# Altium schematic sheet 7_Power_Supply.SchDoc
size A4; Organization: SpaceLab UFSC; Address1: UFSC - SpaceLab; Address2: University Campus - Trindade; Address3: Dep. of Electrical Engineering - CTC; Address4: Florianópolis, Santa Catarina, Brazil; Address5: CEP: 88040 - 900
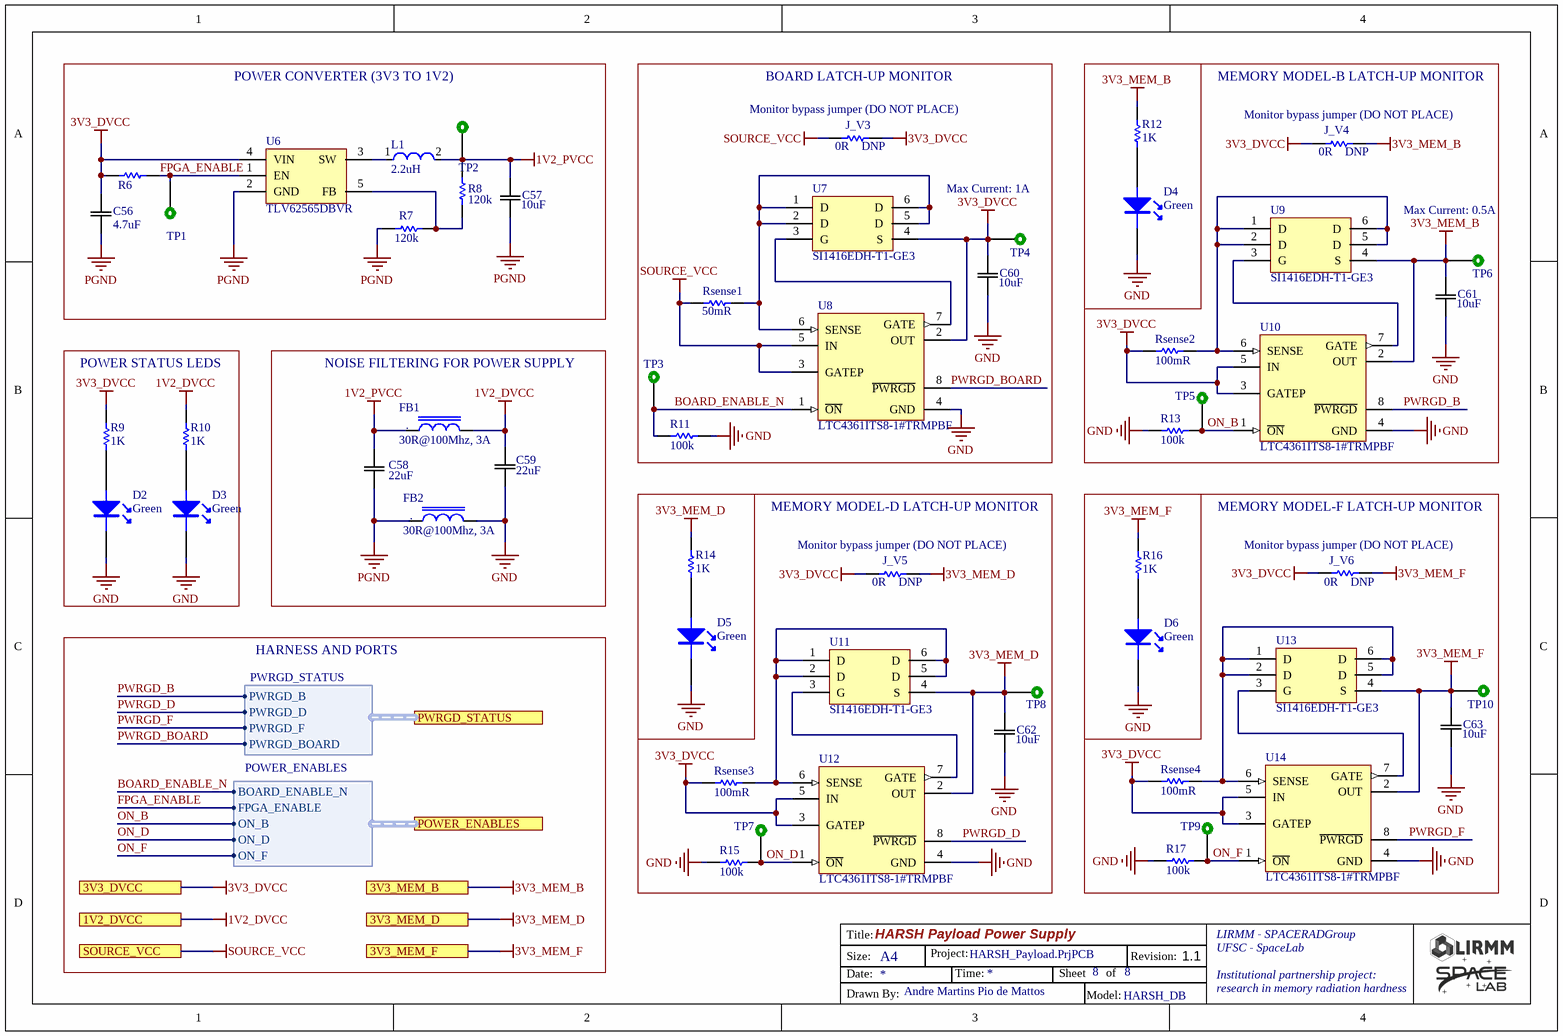
[diagram p0: 7_Power_Supply.SchDoc]

## Parts
C56  4.7uF  [DONE_C0603]
C57  10uF  [DONE_C0603]
C58  22uF  [DONE_C0603]
C59  22uF  [DONE_C0603]
C60  10uF  [DONE_C0603]
C61  10uF  [DONE_C0603]
C62  10uF  [DONE_C0603]
C63  10uF  [DONE_C0603]
D2  Green  [DONE_D0603_GREEN]
D3  Green  [DONE_D0603_GREEN]
D4  Green  [DONE_D0603_GREEN]
D5  Green  [DONE_D0603_GREEN]
D6  Green  [DONE_D0603_GREEN]
FB1  30R@100Mhz, 3A  [DONE_L0805]
FB2  30R@100Mhz, 3A  [DONE_L0805]
J_V3  0R  [DONE_R0603]
J_V4  0R  [DONE_R0603]
J_V5  0R  [DONE_R0603]
J_V6  0R  [DONE_R0603]
L1  value 2.2uH  [DONE_IND_2.2uH]  (hidden comment: DONE_IND_2.2uH)
R6  10k  [DONE_R0603]  (value not drawn)
R7  120k  [DONE_R0603]
R8  120k  [DONE_R0603]
R9  1K  [DONE_R0603]
R10  1K  [DONE_R0603]
R11  100k  [DONE_R0805]
R12  1K  [DONE_R0603]
R13  100k  [DONE_R0805]
R14  1K  [DONE_R0603]
R15  100k  [DONE_R0805]
R16  1K  [DONE_R0603]
R17  100k  [DONE_R0805]
Rsense1  Resistance: 50mR  [DONE_R0603]  (hidden comment: 0.05R)
Rsense2  Resistance: 100mR  [DONE_R0603]  (hidden comment: 0.1)
Rsense3  Resistance: 100mR  [DONE_R0603]  (hidden comment: 0.1)
Rsense4  Resistance: 100mR  [DONE_R0603]  (hidden comment: 0.1)
TP1  TEST_POINT  [DONE_TEST_POINT]  (value not drawn)  (no BOM)
TP2  TEST_POINT  [DONE_TEST_POINT]  (value not drawn)  (no BOM)
TP3  TEST_POINT  [DONE_TEST_POINT]  (value not drawn)  (no BOM)
TP4  TEST_POINT  [DONE_TEST_POINT]  (value not drawn)  (no BOM)
TP5  TEST_POINT  [DONE_TEST_POINT]  (value not drawn)  (no BOM)
TP6  TEST_POINT  [DONE_TEST_POINT]  (value not drawn)  (no BOM)
TP7  TEST_POINT  [DONE_TEST_POINT]  (value not drawn)  (no BOM)
TP8  TEST_POINT  [DONE_TEST_POINT]  (value not drawn)  (no BOM)
TP9  TEST_POINT  [DONE_TEST_POINT]  (value not drawn)  (no BOM)
TP10  TEST_POINT  [DONE_TEST_POINT]  (value not drawn)  (no BOM)
U6  TLV62565DBVR  [DONE_SOT23_5]
U7  SI1416EDH-T1-GE3  [DONE_SOT363_6]
U8  LTC4361ITS8-1#TRMPBF  [DONE_TSOT_23_8]
U9  SI1416EDH-T1-GE3  [DONE_SOT363_6]
U10  LTC4361ITS8-1#TRMPBF  [DONE_TSOT_23_8]
U11  SI1416EDH-T1-GE3  [DONE_SOT363_6]
U12  LTC4361ITS8-1#TRMPBF  [DONE_TSOT_23_8]
U13  SI1416EDH-T1-GE3  [DONE_SOT363_6]
U14  LTC4361ITS8-1#TRMPBF  [DONE_TSOT_23_8]

## Blocks framed on the sheet
POWER CONVERTER (3V3 TO 1V2): C56 C57 L1 R6-R8 TP1 TP2 U6
BOARD LATCH-UP MONITOR: C60 J_V3 R11 Rsense1 TP3 TP4 U7 U8
MEMORY MODEL-B LATCH-UP MONITOR: C61 D4 J_V4 R12 R13 Rsense2 TP5 TP6 U9 U10
POWER STATUS LEDS: D2 D3 R9 R10
NOISE FILTERING FOR POWER SUPPLY: C58 C59 FB1 FB2
MEMORY MODEL-D LATCH-UP MONITOR: C62 D5 J_V5 R14 R15 Rsense3 TP7 TP8 U11 U12
MEMORY MODEL-F LATCH-UP MONITOR: C63 D6 J_V6 R16 R17 Rsense4 TP9 TP10 U13 U14

## Ports
1V2_DVCC, 3V3_DVCC, 3V3_MEM_B, 3V3_MEM_D, 3V3_MEM_F, POWER_ENABLES (harness POWER_ENABLES), PWRGD_STATUS (harness PWRGD_STATUS), SOURCE_VCC

## Harnesses
PWRGD_STATUS: PWRGD_B, PWRGD_D, PWRGD_F, PWRGD_BOARD
POWER_ENABLES: FPGA_ENABLE, ON_B, BOARD_ENABLE_N, ON_D, ON_F

## Nets
1V2_DVCC: C59.1 FB1.2 R10.2 ; port 1V2_DVCC
1V2_PVCC: C57.1 C58.1 FB1.1 L1.2 R8.2 TP2.1
3V3_DVCC: C56.1 C60.1 J_V3.1 J_V4.2 J_V5.2 J_V6.2 R6.2 R9.2 Rsense2.2 Rsense3.2 Rsense4.2 TP4.1 U6.4(VIN) U7.4(S) U8.2(OUT) U10.3(GATEP) U10.5(IN) U12.3(GATEP) U12.5(IN) U14.3(GATEP) U14.5(IN) ; port 3V3_DVCC
3V3_MEM_B: C61.1 J_V4.1 R12.2 TP6.1 U9.4(S) U10.2(OUT) ; port 3V3_MEM_B
3V3_MEM_D: C62.1 J_V5.1 R14.2 TP8.1 U11.4(S) U12.2(OUT) ; port 3V3_MEM_D
3V3_MEM_F: C63.1 J_V6.1 R16.2 TP10.1 U13.4(S) U14.2(OUT) ; port 3V3_MEM_F
GND: C59.2 C60.2 C61.2 C62.2 C63.2 D2.2(K) D3.2(K) D4.2(K) D5.2(K) D6.2(K) FB2.2 R11.1 R13.2 R15.2 R17.2 U8.4(GND) U10.4(GND) U12.4(GND) U14.4(GND)
PGND: C56.2 C57.2 C58.2 FB2.1 R7.2 U6.2(GND)
SOURCE_VCC: J_V3.2 Rsense1.2 U8.3(GATEP) U8.5(IN) ; port SOURCE_VCC
BOARD_ENABLE_N: R11.2 TP3.1 U8.1(~{ON}) ; port POWER_ENABLES.BOARD_ENABLE_N
FPGA_ENABLE: R6.1 TP1.1 U6.1(EN) ; port POWER_ENABLES.FPGA_ENABLE
ON_B: R13.1 TP5.1 U10.1(~{ON}) ; port POWER_ENABLES.ON_B
ON_D: R15.1 TP7.1 U12.1(~{ON}) ; port POWER_ENABLES.ON_D
ON_F: R17.1 TP9.1 U14.1(~{ON}) ; port POWER_ENABLES.ON_F
PWRGD_B: U10.8(~{PWRGD}) ; port PWRGD_STATUS.PWRGD_B
PWRGD_BOARD: U8.8(~{PWRGD}) ; port PWRGD_STATUS.PWRGD_BOARD
PWRGD_D: U12.8(~{PWRGD}) ; port PWRGD_STATUS.PWRGD_D
PWRGD_F: U14.8(~{PWRGD}) ; port PWRGD_STATUS.PWRGD_F
NetD2_1: D2.1(A) R9.1
NetD3_1: D3.1(A) R10.1
NetD4_1: D4.1(A) R12.1
NetD5_1: D5.1(A) R14.1
NetD6_1: D6.1(A) R16.1
NetL1_1: L1.1 U6.3(SW)
NetR7_1: R7.1 R8.1 U6.5(FB)
NetRsense1_1: Rsense1.1 U7.1(D) U7.2(D) U7.5(D) U7.6(D) U8.6(SENSE)
NetRsense2_1: Rsense2.1 U9.1(D) U9.2(D) U9.5(D) U9.6(D) U10.6(SENSE)
NetRsense3_1: Rsense3.1 U11.1(D) U11.2(D) U11.5(D) U11.6(D) U12.6(SENSE)
NetRsense4_1: Rsense4.1 U13.1(D) U13.2(D) U13.5(D) U13.6(D) U14.6(SENSE)
NetU7_3: U7.3(G) U8.7(GATE)
NetU9_3: U9.3(G) U10.7(GATE)
NetU11_3: U11.3(G) U12.7(GATE)
NetU13_3: U13.3(G) U14.7(GATE)

## Notes on the sheet
- (near J_V3) Monitor bypass jumper (DO NOT PLACE)
- (near J_V3) DNP
- (near J_V4) Monitor bypass jumper (DO NOT PLACE)
- (near J_V4) DNP
- Max Current: 1A
- Max Current: 0.5A
- (near J_V5) Monitor bypass jumper (DO NOT PLACE)
- (near J_V5) DNP
- (near J_V6) Monitor bypass jumper (DO NOT PLACE)
- (near J_V6) DNP
- HARNESS AND PORTS
- HARSH Payload Power Supply
- HARSH_Payload.PrjPCB
- 8
- 1.1
- Andre Martins Pio de Mattos
- HARSH_DB
- Title:
- Size:
- Date:
- A4
- Project:
- Time:
- Sheet
- of
- Revision:
- LIRMM - SPACERADGroup
- UFSC - SpaceLab
- Institutional partnership project:
- research in memory radiation hardness
- Drawn By:
- Model:
- (in symbol DONE_FB_30R_3A_100MHz_0805) .

## Library data of the parts
C56 = DONE_CAP_4.7uF_0603_X5R: CAP CER 4.7UF 10V 10% X5R 0603; Partnumber: C0603C475K8PACTU; Category: Ceramic; Dielectric: X5R; Voltage: 10V; Value: 4.7uF
C57 C60-C63 = DONE_CAP_10uF_0603_X5R: CAP CER 10uF 16V 0603 X5R; Partnumber: GRM188R61C106KAALD; Manufacturer: Murata; Tolerance: 10%; NCM: 8532.24.10; Supplier 1: Digi-Key; Manufacturer Part Number: GRM188R61C106KAALD; Stock 1: 0; Pricing 1: 1=0.43, 10=0.302, 100=0.1811, 500=0.1358, 1000=0.1147 (USD); Mount: Surface Mount; Case/Package: 0603; Weight: 0.000222oz; Case Code (Metric): 1608; Case Code (Imperial): 0603; Min Operating Temperature: -55°C; Max Operating Temperature: 85°C; Packaging: Tape and Reel; Voltage Rating: 16V; Dielectric: X5R; Termination: SMD/SMT; Composition: Ceramic; Voltage Rating (DC): 16V; Package Quantity: 4000; Length: 0.063inch; Height: 0.8mm; Width: 0.8mm; Thickness: 0.037inch; REACH SVHC: No SVHC; Lead Free: Lead Free; ComponentLink1URL: http://www.farnell.com/datasheets/2079167.pdf; ComponentLink1Description: http://www.farnell.com/datasheets/2079167.pdf; ComponentLink2URL: http://www.mouser.com/ds/2/281/c02e-2905.pdf; ComponentLink2Description: http://www.mouser.com/ds/2/281/c02e-2905.pdf; ComponentLink3URL: http://search.murata.co.jp/Ceramy/image/img/A01X/partnumbering_e_01.pdf; ComponentLink3Description: http://search.murata.co.jp/Ceramy/image/img/A01X/partnumbering_e_01.pdf; Supplier Part Number 1: 490-10728-1-ND; Capacitance: 10uF
C58 C59 = DONE_CAP_22uF_0603_X5R: CAP CER 22UF 10V X5R 0603; Partnumber: CL10A226MPCNUBE; ComponentLink1URL: http://www.farnell.com/datasheets/2079167.pdf; ComponentLink1Description: http://www.farnell.com/datasheets/2079167.pdf; ComponentLink2URL: http://www.mouser.com/ds/2/281/c02e-2905.pdf; ComponentLink2Description: http://www.mouser.com/ds/2/281/c02e-2905.pdf; ComponentLink3URL: http://search.murata.co.jp/Ceramy/image/img/A01X/partnumbering_e_01.pdf; ComponentLink3Description: http://search.murata.co.jp/Ceramy/image/img/A01X/partnumbering_e_01.pdf; Capacitance: 22uF
D2-D6 = DONE_LED_GREEN_0603: SMD Green LED; Partnumber: HSMQ-C191-T0000; ComponentLink1Description: https://www.digikey.com/product-detail/en/lite-on-inc/LTST-C170KFKT/160-1413-1-ND/386774; ComponentLink1URL: https://www.digikey.com/product-detail/en/lite-on-inc/LTST-C170KFKT/160-1413-1-ND/386774; ComponentLink2Description: https://br.mouser.com/ProductDetail/Lite-On/LTST-C170KFKT?qs=%2Fha2pyFadugHsX7bdQzWjMrioqtf8F%2FEFUVxYkqdVx%252BrRWuVMVludQ%3D%3D; ComponentLink2URL: https://br.mouser.com/ProductDetail/Lite-On/LTST-C170KFKT?qs=%2Fha2pyFadugHsX7bdQzWjMrioqtf8F%2FEFUVxYkqdVx%252BrRWuVMVludQ%3D%3D; ComponentLink3URL: https://www.verical.com/server-webapp/html/getDatasheet?partID=158266&src-supplier=Verical; ComponentLink3Description: https://www.verical.com/server-webapp/html/getDatasheet?partID=158266&src-supplier=Verical; ComponentLink4URL: http://optoelectronics.liteon.com/upload/download/DS-22-99-0185/LTST-C170KFKT.pdf?src-supplier=Digi-Key; ComponentLink4Description: http://optoelectronics.liteon.com/upload/download/DS-22-99-0185/LTST-C170KFKT.pdf?src-supplier=Digi-Key; ComponentLink5URL: http://www1.futureelectronics.com/doc/LITE-ON/LTST-C170KFKT.pdf?src-supplier=Future+Electronics; ComponentLink5Description: http://www1.futureelectronics.com/doc/LITE-ON/LTST-C170KFKT.pdf?src-supplier=Future+Electronics; ComponentLink6URL: http://www.mouser.com/ds/2/239/Lite-On-LTST-C170KFKT-187690.pdf?src-supplier=Mouser; ComponentLink6Description: http://www.mouser.com/ds/2/239/Lite-On-LTST-C170KFKT-187690.pdf?src-supplier=Mouser
FB1 FB2 = DONE_FB_30R_3A_100MHz_0805: Ferrite Bead 30 OHM 3A 100MHz; Partnumber: BLM21PG300SN1D; NCM: 8504.50.00
J_V3-J_V6 = DONE_RES_0R_0603: RES SMD 0 OHM JUMPER 1/10W 0603; Partnumber: RC0603JR-070RL; Case Code (Imperial): 0603; ComponentLink1URL: http://www.mouser.com/ds/2/427/mcat_pro-223602.pdf; ComponentLink1Description: http://www.mouser.com/ds/2/427/mcat_pro-223602.pdf; ComponentLink2URL: http://www.vishay.com/docs/28760/mcat_pro.pdf; ComponentLink2Description: http://www.vishay.com/docs/28760/mcat_pro.pdf
L1 = DONE_IND_2.2uH: Inductor Power Chip Shielded Wirewound 2.2uH 20% 1MHz Ferrite 1.8A 0.0588Ohm DCR 1515 T/R; Partnumber: LQH44PN2R2MP0L
R6 = DONE_RES_10K_0603: 1/8W 1%  0603 10K; Partnumber: MCT0603MC1002FP500; Manufacturer: Vishay Beyschlag; Resistance: 10kR; Power Rating: 125mW; Voltage Rating: 75V; NCM: 8533.21.20; Supplier 1: Digi-Key; Manufacturer Part Number: MCT0603MC1002FP500; Stock 1: 29986; Pricing 1: 1=0.37, 10=0.313, 100=0.1222, 1000=0.0511, 2500=0.0469 (USD); Case/Package: 0603; Weight: 7.1E-05oz; Case Code (Imperial): 0603; Case Code (Metric): 1608; Min Operating Temperature: -55°C; Max Operating Temperature: 155°C; Packaging: Tape and Reel; Tolerance: 1%; Package Quantity: 5000; Termination: SMD/SMT; Composition: Thin Film; Length: 1.6mm; Height: 0.45mm; Width: 0.8mm; ComponentLink1URL: http://www.mouser.com/ds/2/427/mcat_pro-223602.pdf; ComponentLink1Description: http://www.mouser.com/ds/2/427/mcat_pro-223602.pdf; ComponentLink2URL: http://www.vishay.com/docs/28760/mcat_pro.pdf; ComponentLink2Description: http://www.vishay.com/docs/28760/mcat_pro.pdf; Supplier Part Number 1: MCT0603-10.0K-MFCT-ND
R7 R8 = DONE_RES_120K_0603: 1/10W 1%  0603; Partnumber: CRCW0603120KFKEAC; Manufacturer: Vishay Beyschlag; Power Rating: 100mW; Voltage Rating: 75V; NCM: 8533.21.20; Manufacturer Part Number: CRCW0603120KFKEAC; Case/Package: 0603; Weight: 7.1E-05oz; Case Code (Imperial): 0603; Case Code (Metric): 1608; Min Operating Temperature: -55°C; Max Operating Temperature: 155°C; Packaging: Tape and Reel; Tolerance: 1%; Termination: SMD/SMT; Composition: Thin Film; Length: 1.55mm; Height: 0.45mm; Width: 0.8mm; Resistance: 120k
R9 R10 R12 R14 R16 = DONE_RES_1K_0603: RES SMD 1K OHM 1% 1/4W 0603; Manufacturer: Rohm; Manufacturer Part Number: ESR03EZPF1001; Power Rating: 250mW; Temperature Coefficient: 100ppm/°C; ComponentLink1Description: digikey; ComponentLink1URL: https://www.digikey.com/product-detail/en/rohm-semiconductor/ESR03EZPF1001/RHM1.00KADCT-ND/1983752; Supplier 1: Digi-Key; Stock 1: 24170; Pricing 1: 1=0.14, 10=0.126, 100=0.0484, 1000=0.0213, 2500=0.0184 (USD); Case/Package: 0603; Case Code (Metric): 1608; Case Code (Imperial): 0603; Min Operating Temperature: -55°C; Max Operating Temperature: 155°C; Package Quantity: 1; Tolerance: 1%; Packaging: Tape and Reel; Composition: Thick Film; Number of Terminations: 2; Max Power Dissipation: 250mW; Length: 0.063inch; Height: 0.022inch; Width: 0.031inch; Lead Free: Lead Free; ComponentLink2URL: https://datasheet.ciiva.com/2469/esr-2469712.pdf; ComponentLink2Description: https://datasheet.ciiva.com/2469/esr-2469712.pdf; ComponentLink3URL: https://datasheet.ciiva.com/2469/esr-2469713.pdf; ComponentLink3Description: https://datasheet.ciiva.com/2469/esr-2469713.pdf; ComponentLink4URL: https://datasheet.ciiva.com/2469/esr-2469714.pdf; ComponentLink4Description: https://datasheet.ciiva.com/2469/esr-2469714.pdf; Supplier Part Number 1: RHM1.00KADCT-ND; Resistance: 1K; Partnumber: ESR03EZPF1001
R11 R13 R15 R17 = DONE_RES_100k_0805: RES 100K OHM 1/8W 1% 0805; Partnumber: AC0805FR-13100KL; Manufacturer: Yageo; Manufacturer Part Number: RC0805FR-07100KL; Temperature Coefficient: 100ppm/°C; Power Rating: 125mW; Voltage Rating (DC): 150V; NCM: 8533.21.20; ComponentLink1Description: https://www.digikey.com/product-detail/en/yageo/RC0805FR-07100KL/311-100KCRCT-ND/730491; ComponentLink1URL: https://www.digikey.com/product-detail/en/yageo/RC0805FR-07100KL/311-100KCRCT-ND/730491; ComponentLink2Description: https://br.mouser.com/ProductDetail/Yageo/RC0805FR-07100KL?qs=%2Fha2pyFadugqH4HCO4lefXR2vnSIcQedeLFD%252BIWbuSwm%252BtiKkObUBg%3D%3D; ComponentLink2URL: https://br.mouser.com/ProductDetail/Yageo/RC0805FR-07100KL?qs=%2Fha2pyFadugqH4HCO4lefXR2vnSIcQedeLFD%252BIWbuSwm%252BtiKkObUBg%3D%3D; Supplier 1: Digi-Key; Supplier Part Number 1: 311-100KCRCT-ND; Stock 1: 5685931; Pricing 1: 1=0.1, 10=0.04, 100=0.0163, 1000=0.00731, 2500=0.00635 (USD); Case/Package: 0805; Number of Pins: 2; Case Code (Metric): 2012; Case Code (Imperial): 0805; Min Operating Temperature: -55°C; Max Operating Temperature: 155°C; Composition: Thick Film; Tolerance: 1%; Packaging: Tape and Reel; Voltage Rating: 150V; Package Quantity: 1; Number of Terminations: 2; Termination: SMD/SMT; Military Standard: Not; Max Power Dissipation: 125mW; Features: Moisture Resistant; Length: 2mm; Height: 0.024inch; Width: 0.049inch; Depth: 1.25mm; Lead Pitch: 0.4mm; REACH SVHC: Unknown; Lead Free: Lead Free; ComponentLink3URL: http://www.yageo.com/documents/recent/PYu-RC_Group_51_RoHS_L_10.pdf?src-supplier=Digi-Key; ComponentLink3Description: http://www.yageo.com/documents/recent/PYu-RC_Group_51_RoHS_L_10.pdf?src-supplier=Digi-Key; ComponentLink4URL: http://www.yageo.com/documents/recent/PYu-RC_Group_51_RoHS_L_9.pdf?src-supplier=Mouser; ComponentLink4Description: http://www.yageo.com/documents/recent/PYu-RC_Group_51_RoHS_L_9.pdf?src-supplier=Mouser; ComponentLink5URL: http://documents.rs-components.com/techlib://itc_doclist_GB.htm?stockno=6185113&src-supplier=RSComponents; ComponentLink5Description: http://documents.rs-components.com/techlib://itc_doclist_GB.htm?stockno=6185113&src-supplier=RSComponents; ComponentLink6URL: http://www.yageo.ru/pdf/RC0805.pdf?src-supplier=Future+Electronics; ComponentLink6Description: http://www.yageo.ru/pdf/RC0805.pdf?src-supplier=Future+Electronics; ComponentLink7URL: http://www.farnell.com/datasheets/38627.pdf?src-supplier=Element14; ComponentLink7Description: http://www.farnell.com/datasheets/38627.pdf?src-supplier=Element14; ComponentLink8URL: http://www.farnell.com/datasheets/2167052.pdf?src-supplier=Element14; ComponentLink8Description: http://www.farnell.com/datasheets/2167052.pdf?src-supplier=Element14; ComponentLink9URL: http://www.farnell.com/datasheets/1686128.pdf?src-supplier=Element14; ComponentLink9Description: http://www.farnell.com/datasheets/1686128.pdf?src-supplier=Element14; ComponentLink10URL: http://www.farnell.com/datasheets/444164.pdf?src-supplier=Element14; ComponentLink10Description: http://www.farnell.com/datasheets/444164.pdf?src-supplier=Element14; Supplier 2: Mouser; Supplier Part Number 2: 603-RC0805FR-07100KL; Stock 2: 2067874; Pricing 2: 1=0.13, 10=0.031, 100=0.011, 1000=0.008, 5000=0.005, 10000=0.005 (USD); Resistance: 100k
Rsense1 = DONE_RES_0.05R_0603: RES 0.05 OHM 1% 1/3W 0603; Partnumber: ERJ-3BWFR050V; Power Rating: 0.33W; Voltage Rating (DC): 250V; Supplier 1: Digi-Key
Rsense2-Rsense4 = DONE_RES_0.1R_0603: RES 100 OHM 1% 1/8W 0603; Partnumber: RNCP0603FTD100R; Power Rating: 0.125W; Voltage Rating (DC): 250V; Supplier 1: Digi-Key
TP1-TP10 = DONE_TEST_POINT: Test point
U6 = DONE_TLV62565DBVR: IC REG BUCK ADJ 1.5A SOT23-5; Manufacturer: Texas Instruments; Mount Type: SMD; Category: Regulator; Partnumber: TLV62565DBVR
U7 U9 U11 U13 = DONE_SI1416EDH-T1-GE3: MOSFET 30V Vds 12V Vgs SC70-6 SOT-363-6; Manufacturer: Vishay; Mount Type: SMD; Category: MOSFET; Partnumber: SI1416EDH-T1-GE3
U8 U10 U12 U14 = DONE_LTC4361ITS8-1: Overvoltage / Overcurrent Protection Controller, 2.5 to 80 V Vin, 8-pin SOT23 (TS8-8), -40 to 85 degC, Pb-Free, Mini Tape and Reel; Manufacturer: Linear Technology; Foldback: no; Circuit Breakers(#): 1; Power Good: yes; Circuit Breaker Threshold: 50 mV; Circuit Breaker Accuracy(%): 10; Extended Temp: C, I, H; Mounting Technology: Surface Mount; ComponentLink1Description: Manufacturer URL; ComponentLink2Description: Datasheet; DatasheetVersion: Rev. B; ComponentLink3URL: http://cds.linear.com/docs/en/packaging/SOT_8_05-08-1637.pdf; ComponentLink1URL: http://www.linear.com/; Active Limiting: no; Code_JEDEC: MO-193; Packing: Mini Tape and Reel; ComponentLink2URL: http://cds.linear.com/docs/en/datasheet/436112fb.pdf; Reset: no; ComponentLink3Description: Package Specification; Fault: no; Fast Comparator: no; PackageVersion: Rev. A, 08/2010; Vin Range: 2.5 to 80 V; RoHS: TRUE; PackageReference: TS8-8; PackageDescription: 8-Pin Plastic TSOT-23, Body 2.9 x 1.63 mm, Pitch 0.65 mm; PartNumber: LTC4361ITS8-1#TRMPBF